# Altium schematic sheet 03) PIO Muxing.SchDoc
size C; SheetTitle: **; CompanyName: Microchip Technology Inc.; Organization: Microchip Technology; Address1: 2355 West Chandler Blvd.; Address2: Chandler, AZ  85224; Address4: USA; DocumentNumber: 3; SheetNumber: 3; SheetTotal: 9; Time: Time
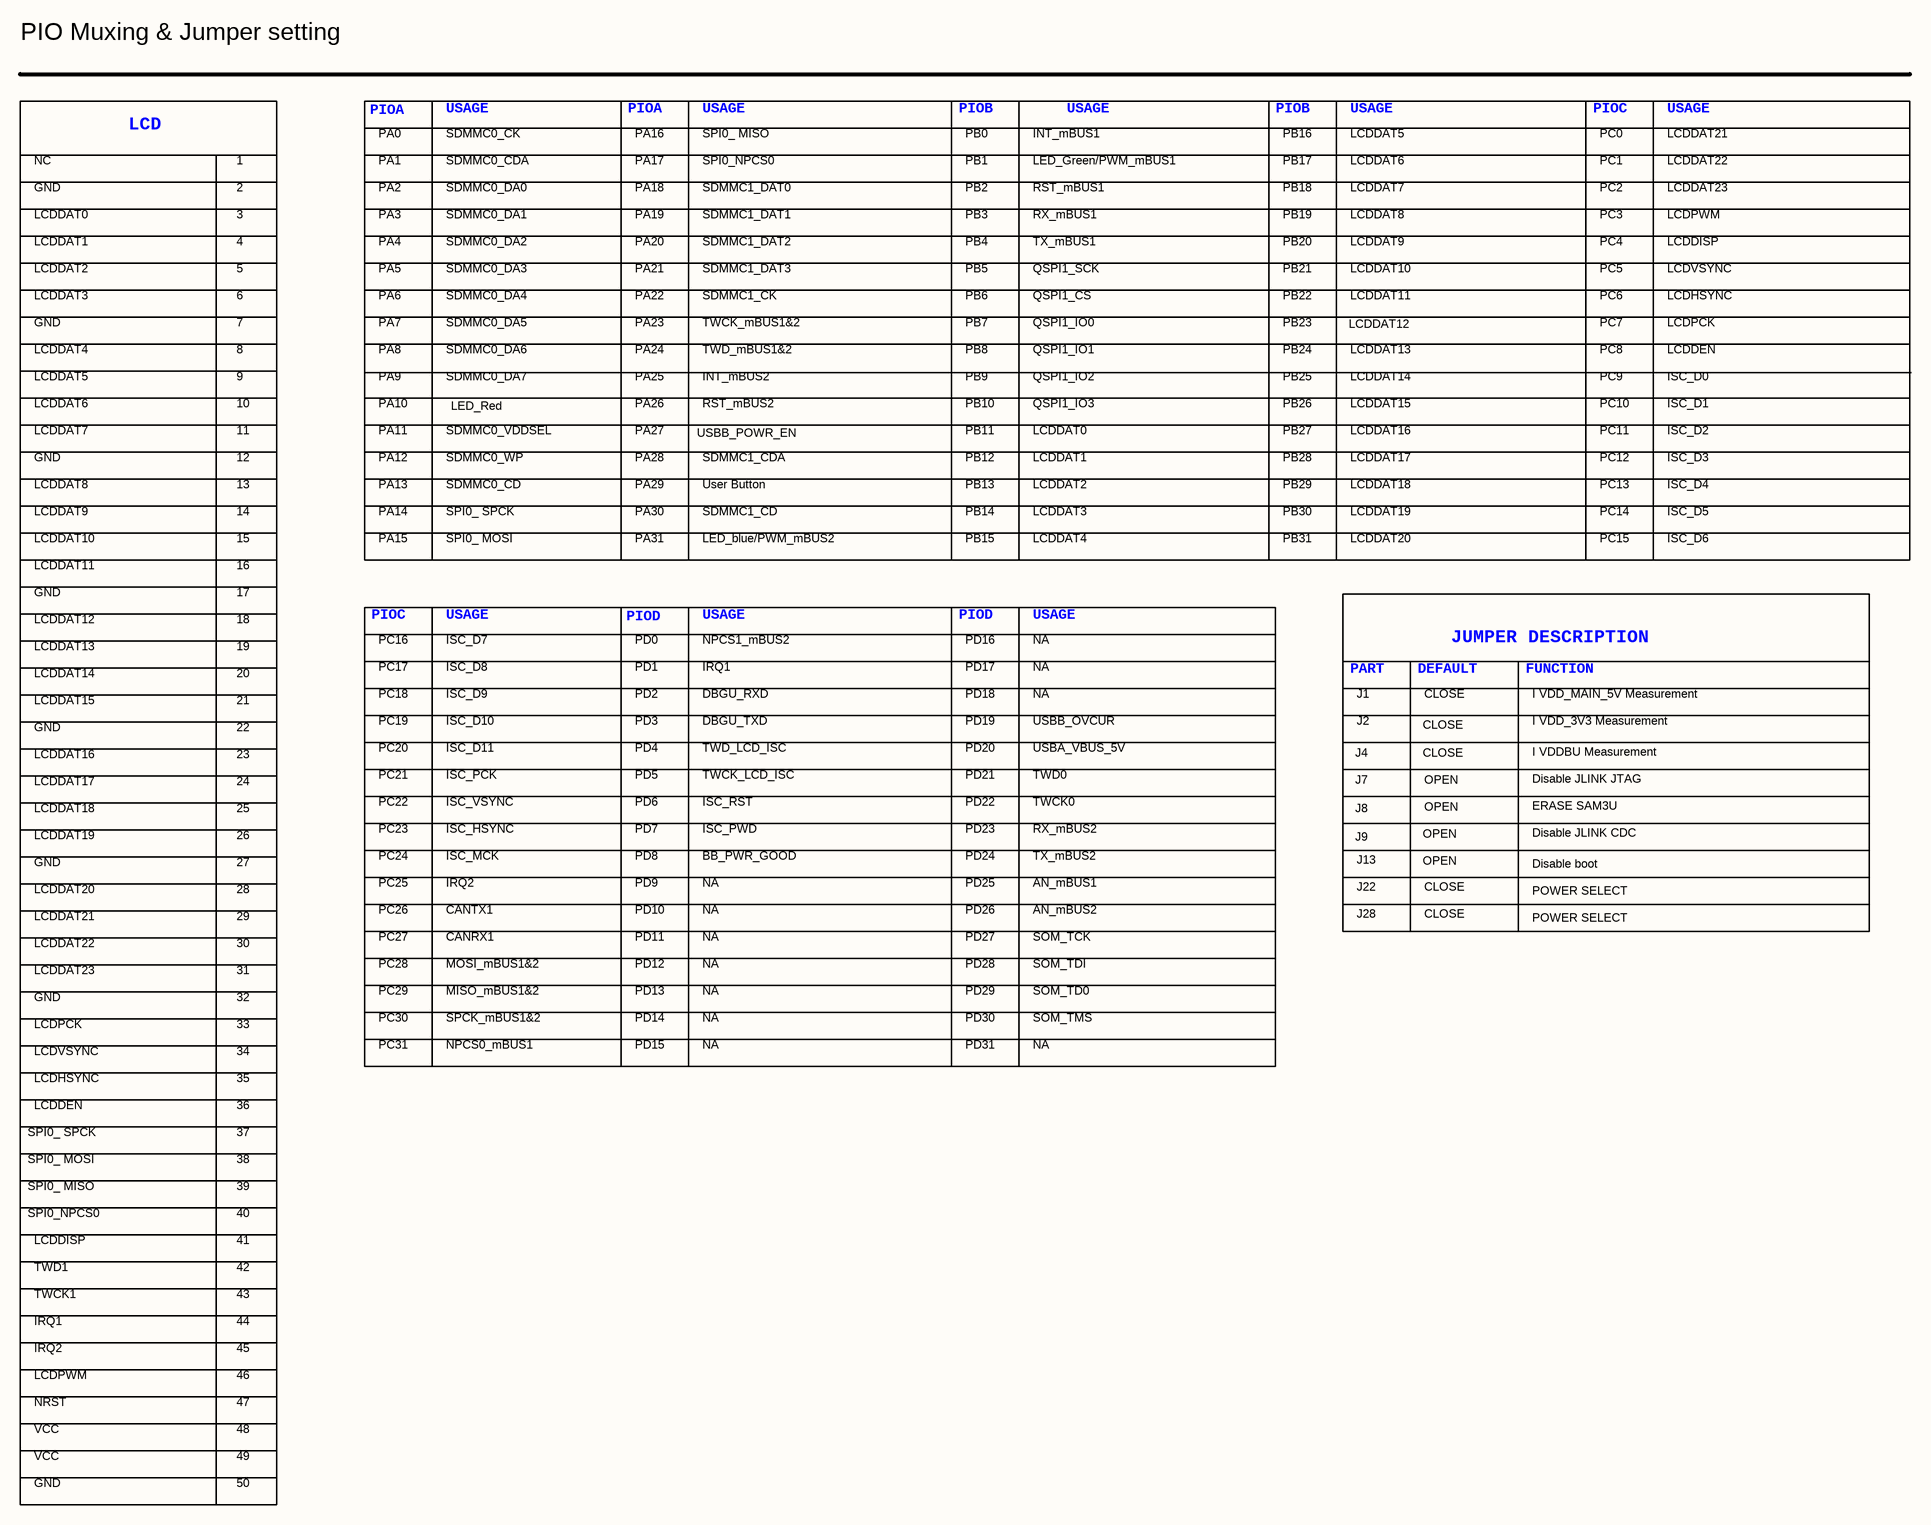
[diagram p0: 03) PIO Muxing.SchDoc]

## Parts
?  (no value)  (graphical)

## Notes on the sheet
- PIO Muxing & Jumper setting
- LCD
- PIOA
- PA0
- SDMMC0_CK
- USAGE
- PA16
- SPI0_ MISO
- PIOB
- PB0
- INT_mBUS1
- PB16
- LCDDAT5
- PIOC
- PC0
- LCDDAT21
- NC
- LCDDAT0
- GND
- 1
- 2
- 3
- PA1
- PA2
- PA3
- SDMMC0_CDA
- SDMMC0_DA1
- SDMMC0_DA0
- PA17
- PA18
- PA19
- SPI0_NPCS0
- SDMMC1_DAT1
- SDMMC1_DAT0
- PB3
- PB1
- PB2
- LED_Green/PWM_mBUS1
- RX_mBUS1
- RST_mBUS1
- PB17
- PB18
- PB19
- LCDDAT6
- LCDDAT8
- LCDDAT7
- PC1
- PC2
- PC3
- LCDPWM
- LCDDAT23
- LCDDAT22
- LCDDAT1
- LCDDAT2
- 4
- 5
- PA4
- PA5
- SDMMC0_DA3
- SDMMC0_DA2
- PA21
- PA20
- SDMMC1_DAT3
- SDMMC1_DAT2
- PB4
- PB5
- QSPI1_SCK
- TX_mBUS1
- PB21
- PB20
- LCDDAT10
- LCDDAT9
- PC5
- PC4
- LCDVSYNC
- LCDDISP
- LCDDAT3
- LCDDAT4
- 6
- 7
- 8
- PA6
- PA7
- PA8
- SDMMC0_DA5
- SDMMC0_DA4
- SDMMC0_DA6
- PA24
- PA23
- PA22
- TWCK_mBUS1&2
- SDMMC1_CK
- TWD_mBUS1&2
- PB6
- PB7
- PB8
- QSPI1_IO0
- QSPI1_CS
- QSPI1_IO1
- PB22
- PB23
- PB24
- LCDDAT12
- LCDDAT11
- LCDDAT13
- PC7
- PC8
- PC6
- LCDDEN
- LCDPCK
- LCDHSYNC
- 9
- 10
- PA9
- PA10
- SDMMC0_DA7
- LED_Red
- PA26
- PA25
- RST_mBUS2
- INT_mBUS2
- PB10
- PB9
- QSPI1_IO2
- QSPI1_IO3
- PB26
- PB25
- LCDDAT15
- LCDDAT14
- PC9
- PC10
- ISC_D1
- ISC_D0
- 11
- 12
- 13
- PA11
- PA12
- PA13
- SDMMC0_WP
- SDMMC0_VDDSEL
- SDMMC0_CD
- PA27
- PA29
- PA28
- USBB_POWR_EN
- SDMMC1_CDA
- User Button
- PB13
- PB12
- PB11
- PB29
- PB28
- PB27
- LCDDAT17
- LCDDAT16
- LCDDAT18
- PC11
- PC12
- PC13
- ISC_D4
- ISC_D2
- ISC_D3
- 14
- 15
- PA14
- PA15
- SPI0_ MOSI
- SPI0_ SPCK
- PA31
- PA30
- LED_blue/PWM_mBUS2
- SDMMC1_CD
- PB15
- PB14
- PB30
- PB31
- LCDDAT20
- LCDDAT19
- PC14
- PC15
- ISC_D6
- ISC_D5
- 16
- 17
- 18
- PIOD
- 19
- 20
- PC16
- PC17
- PC18
- ISC_D9
- ISC_D8
- ISC_D7
- PD0
- PD2
- PD1
- IRQ1
- DBGU_RXD
- NPCS1_mBUS2
- PD16
- PD17
- PD18
- NA
- PART
- J1
- DEFAULT
- CLOSE
- JUMPER DESCRIPTION
- FUNCTION
- I VDD_MAIN_5V Measurement
- 21
- 22
- 23
- PC19
- PC20
- ISC_D11
- ISC_D10
- PD3
- PD4
- DBGU_TXD
- TWD_LCD_ISC
- PD19
- PD20
- USBB_OVCUR
- USBA_VBUS_5V
- J4
- J2
- I VDD_3V3 Measurement
- I VDDBU Measurement
- 24
- 25
- PC21
- PC22
- PC23
- ISC_PCK
- ISC_HSYNC
- ISC_VSYNC
- PD5
- PD6
- PD7
- TWCK_LCD_ISC
- ISC_RST
- ISC_PWD
- PD21
- PD23
- PD22
- TWD0
- TWCK0
- RX_mBUS2
- J7
- J8
- OPEN
- Disable JLINK JTAG
- Disable JLINK CDC
- ERASE SAM3U
- 26
- 27
- 28
- PC24
- PC25
- IRQ2
- ISC_MCK
- PD8
- PD9
- BB_PWR_GOOD
- PD24
- PD25
- AN_mBUS1
- TX_mBUS2
- J9
- J13
- J22
- Disable boot
- POWER SELECT
- 29
- 30
- PC26
- PC27
- PC28
- CANRX1
- MOSI_mBUS1&2
- CANTX1
- PD10
- PD12
- PD11
- PD26
- PD27
- PD28
- SOM_TDI
- SOM_TCK
- AN_mBUS2
- J28
- 31
- 32
- 33
- PC29
- PC30
- SPCK_mBUS1&2
- MISO_mBUS1&2
- PD13
- PD14
- PD30
- PD29
- SOM_TMS
- SOM_TD0
- 34
- 35
- PC31
- NPCS0_mBUS1
- PD15
- PD31
- 36
- 37
- 38
- 39
- 40
- TWD1
- TWCK1
- 41
- 42
- 43
- 44
- 45
- VCC
- NRST
- 46
- 47
- 48
- 49
- 50
- Drawn By:
- Sheet Title
- Engineer:
- PartNumber:
- Project Title
- Designed with
- File:
- Size
- C
- Revision:
- Sch #:
- Date:
- Sheet
- Altium.com <http://go.altium.com/MicrochipLandingPage_Evaluation.html>

## Library data of the parts
? = Title Block C